# Altium schematic sheet LEDs_Sheet_2.SchDoc
size A4; SheetNumber: 3; SheetTotal: 3
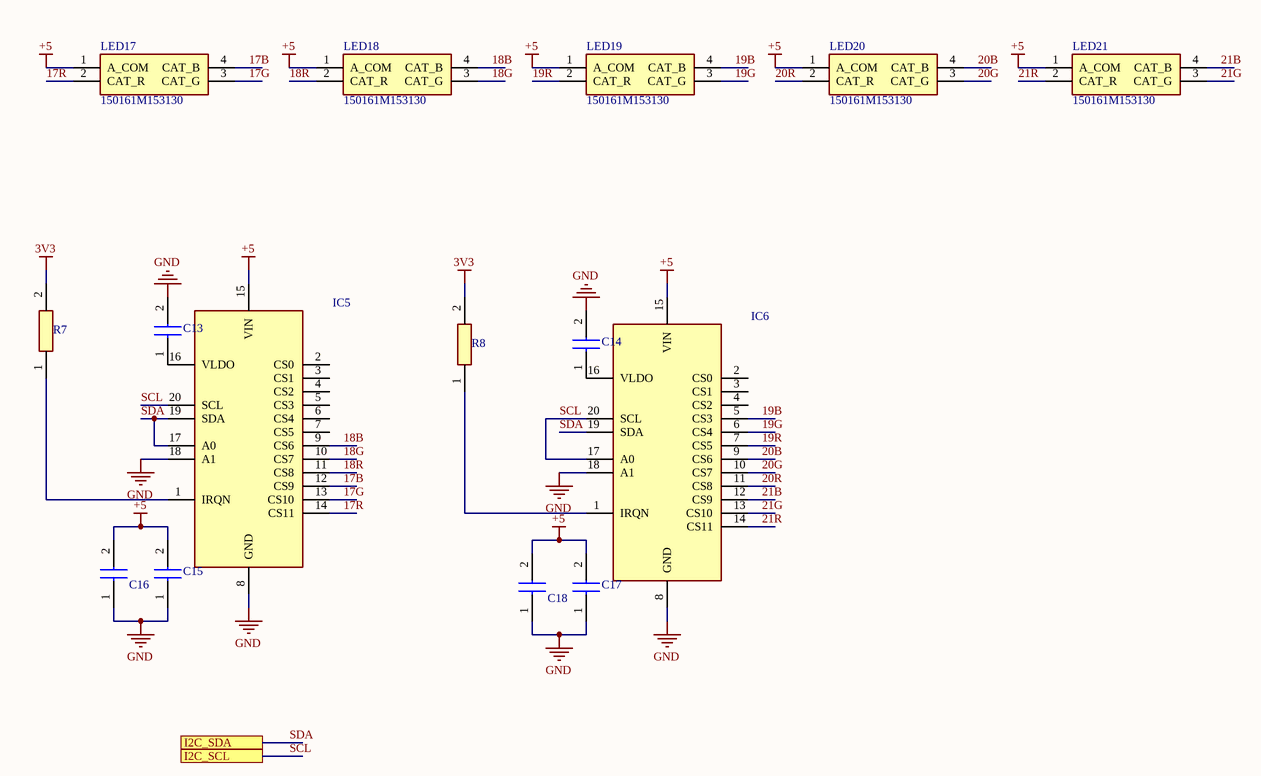
[diagram p0: LEDs_Sheet_2.SchDoc]

## Parts
C13  C0402C105K9PAC  [CAPC1005X55N]  (value not drawn)
C14  C0402C105K9PAC  [CAPC1005X55N]  (value not drawn)
C15  C0402C105K9PAC  [CAPC1005X55N]  (value not drawn)
C16  C1005X7S1A225K050BC  [C1005_Commercial]  (value not drawn)
C17  C0402C105K9PAC  [CAPC1005X55N]  (value not drawn)
C18  C1005X7S1A225K050BC  [C1005_Commercial]  (value not drawn)
IC5  LED1202JR  [QFN20 3x3 (0,5mm pitch)]  (value not drawn)
IC6  LED1202JR  [QFN20 3x3 (0,5mm pitch)]  (value not drawn)
LED17  150161M153130  [150161M153130]
LED18  150161M153130  [150161M153130]
LED19  150161M153130  [150161M153130]
LED20  150161M153130  [150161M153130]
LED21  150161M153130  [150161M153130]
R7  MCS04020D1001BE000  [RESC1005X37N]  (value not drawn)
R8  MCS04020D1001BE000  [RESC1005X37N]  (value not drawn)

## Ports
I2C_SCL, I2C_SDA

## Nets
3V3: R7.2 R8.2
+5: C15.2 C16.2 C17.2 C18.2 IC5.15(VIN) IC6.15(VIN) LED17.1(A_COM) LED18.1(A_COM) LED19.1(A_COM) LED20.1(A_COM) LED21.1(A_COM)
GND: C13.2 C14.2 C15.1 C16.1 C17.1 C18.1 IC5.8(GND) IC5.18(A1) IC6.8(GND) IC6.18(A1)
17B: IC5.12(CS9) LED17.4(CAT_B)
17G: IC5.13(CS10) LED17.3(CAT_G)
17R: IC5.14(CS11) LED17.2(CAT_R)
18B: IC5.9(CS6) LED18.4(CAT_B)
18G: IC5.10(CS7) LED18.3(CAT_G)
18R: IC5.11(CS8) LED18.2(CAT_R)
19B: IC6.5(CS3) LED19.4(CAT_B)
19G: IC6.6(CS4) LED19.3(CAT_G)
19R: IC6.7(CS5) LED19.2(CAT_R)
20B: IC6.9(CS6) LED20.4(CAT_B)
20G: IC6.10(CS7) LED20.3(CAT_G)
20R: IC6.11(CS8) LED20.2(CAT_R)
21B: IC6.12(CS9) LED21.4(CAT_B)
21G: IC6.13(CS10) LED21.3(CAT_G)
21R: IC6.14(CS11) LED21.2(CAT_R)
SCL: IC5.20(SCL) IC6.17(A0) IC6.20(SCL) ; port I2C_SCL
SDA: IC5.17(A0) IC5.19(SDA) IC6.19(SDA) ; port I2C_SDA
NetC13_1: C13.1 IC5.16(VLDO)
NetC14_1: C14.1 IC6.16(VLDO)
NetIC5_1: IC5.1(IRQN) R7.1
NetIC6_1: IC6.1(IRQN) R8.1

Not connected (* = marked no-connect by the designer): IC5 2(CS0) 3(CS1) 4(CS2) 5(CS3) 6(CS4) 7(CS5); IC6 2(CS0) 3(CS1) 4(CS2)

## Library data of the parts
C13-C15 C17 = C0402C105K9PAC: Capacitor; Manufacturer_Name: KEMET; Datasheet Link: https://content.kemet.com/datasheets/KEM_C1002_X7R_SMD.pdf; Height: 0.55mm; Manufacturer_Part_Number: C0402C105K9PAC; Mouser Part Number: 80-C0402C105K9PAC; Mouser Price/Stock: https://www.mouser.co.uk/ProductDetail/KEMET/C0402C105K9PAC?qs=AHS6Mz2dKxPyNrxaU50ZkQ%3D%3D; Arrow Part Number: C0402C105K9PAC; Arrow Price/Stock: https://www.arrow.com/en/products/c0402c105k9pac/kemet-corporation?region=nac
C16 C18 = C1005X7S1A225K050BC: 2µ2F 0402; Manufacturer_Name: TDK; Datasheet Link: https://product.tdk.com/system/files/dam/doc/product/capacitor/ceramic/mlcc/catalog/mlcc_commercial_general_en.pdf; Height: 0.55mm; Manufacturer_Part_Number: C1005X7S1A225K050BC; Mouser Part Number: 810-C1005X7S1A225K; Mouser Price/Stock: https://www.mouser.co.uk/ProductDetail/TDK/C1005X7S1A225K050BC?qs=dfay7wIA1uFANmjMJAzwOA%3D%3D; Arrow Part Number: C1005X7S1A225K050BC; Arrow Price/Stock: https://www.arrow.com/en/products/c1005x7s1a225k050bc/tdk?region=nac
IC5 IC6 = LED1202JR: Integrated Circuit; Manufacturer_Name: STMicroelectronics; Datasheet Link: https://componentsearchengine.com/Datasheets/1/LED1202JR.pdf; Height: 0.653mm; Manufacturer_Part_Number: LED1202JR; Mouser Part Number: 511-LED1202JR; Mouser Price/Stock: https://www.mouser.co.uk/ProductDetail/STMicroelectronics/LED1202JR?qs=P19jvy6W2mcPsIm9dkDZbQ%3D%3D; Arrow Part Number: LED1202JR; Arrow Price/Stock: https://www.arrow.com/en/products/led1202jr/stmicroelectronics?region=nac
LED17-LED21 = 150161M153130: LED; Manufacturer_Name: Wurth Elektronik; Datasheet Link: https://www.mouser.co.uk/datasheet/2/445/150161M153130-1838821.pdf; Height: 1.7mm; Manufacturer_Part_Number: 150161M153130; Mouser Part Number: 710-150161M153130; Mouser Price/Stock: https://www.mouser.co.uk/ProductDetail/Wurth-Elektronik/150161M153130?qs=GedFDFLaBXEcD4evLrps3w%3D%3D
R7 R8 = MCS04020D1001BE000: Resistor 1k 0402; Manufacturer_Name: Vishay; Datasheet Link: http://www.vishay.com/docs/28705/mcx0x0xpro.pdf; Height: 0.37mm; Manufacturer_Part_Number: MCS04020D1001BE000; Mouser Part Number: 594-MCS04020D1001BE0; Mouser Price/Stock: https://www.mouser.co.uk/ProductDetail/Vishay-Beyschlag/MCS04020D1001BE000?qs=H5EaGE3Pc5m43MFwYZQH1Q%3D%3D